# EAGLE design avalanche_PSU (EAGLE 6.5.0)
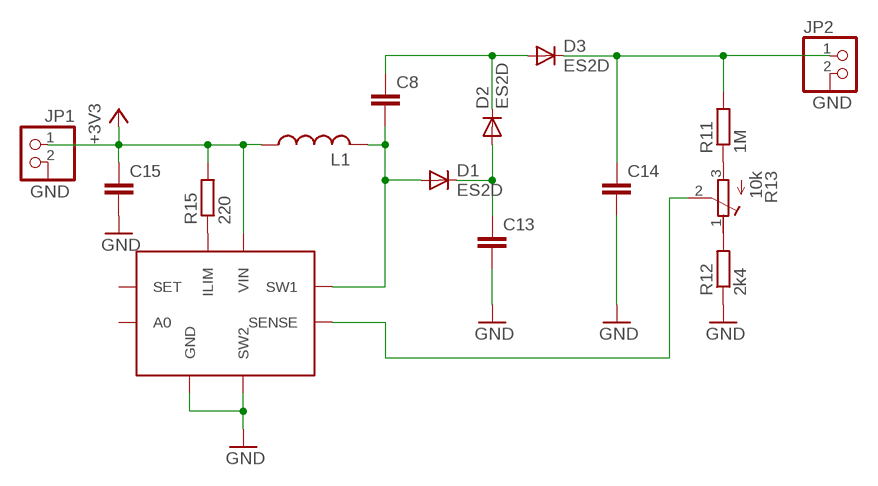
[diagram p0: schematic, sheet 1]

## Parts
C8  C-EUC0805K  [C0805K]
C13  C-EUC0805K  [C0805K]
C14  C-EUC0805K  [C0805K]
C15  C-EUC1206  [C1206]
D1  ES2D  [SMB]
D2  ES2D  [SMB]
D3  ES2D  [SMB]
JP1  PINHD-1X2  [1X02]
JP2  PINHD-1X2  [1X02]
L1  L-US  [SRR1280]
R11  1M  R-EU_M0805  [M0805]
R12  2k4  R-EU_M0805  [M0805]
R13  10k  R-TRIMMT18  [RTRIMT18]
R15  220  R-EU_M0805  [M0805]
U$3  LT1073  [DIL08]

## Nets
+3V3: C15.1 JP1.1 L1.P$1 R15.2 U$3.2(VIN)
GND: C13.2 C14.2 C15.2 JP1.2 JP2.2 R12.1 U$3.4(SW2) U$3.5(GND)
N$13: C13.1 D1.C D2.A
N$24: C8.1 D2.C D3.A
N$25: C14.1 D3.C JP2.1 R11.2
N$37: C8.2 D1.A L1.P$2 U$3.3(SW1)
N$38: R12.2 R13.1(A)
N$39: R11.1 R13.3(E)
N$40: R13.2(S) U$3.8(SENSE)
N$41: R15.1 U$3.1(ILIM)
Unconnected: U$3.6(A0) U$3.7(SET)

## Library data of the parts
C8 C13-C15 = resistor:C-EU: CAPACITOR, European symbol
D1-D3 = diode:ES2D: DIODE super fast rectifier, 2 A
JP1 JP2 = pinhead:PINHD-1X2: PIN HEADER
L1 = SRR1280:L-US: INDUCTOR, American symbol
R11 R12 R15 = resistor:R-EU_: RESISTOR, European symbol
R13 = resistor:R-TRIMM: Trimm resistor
U$3 = LT1073:LT1073

## Board
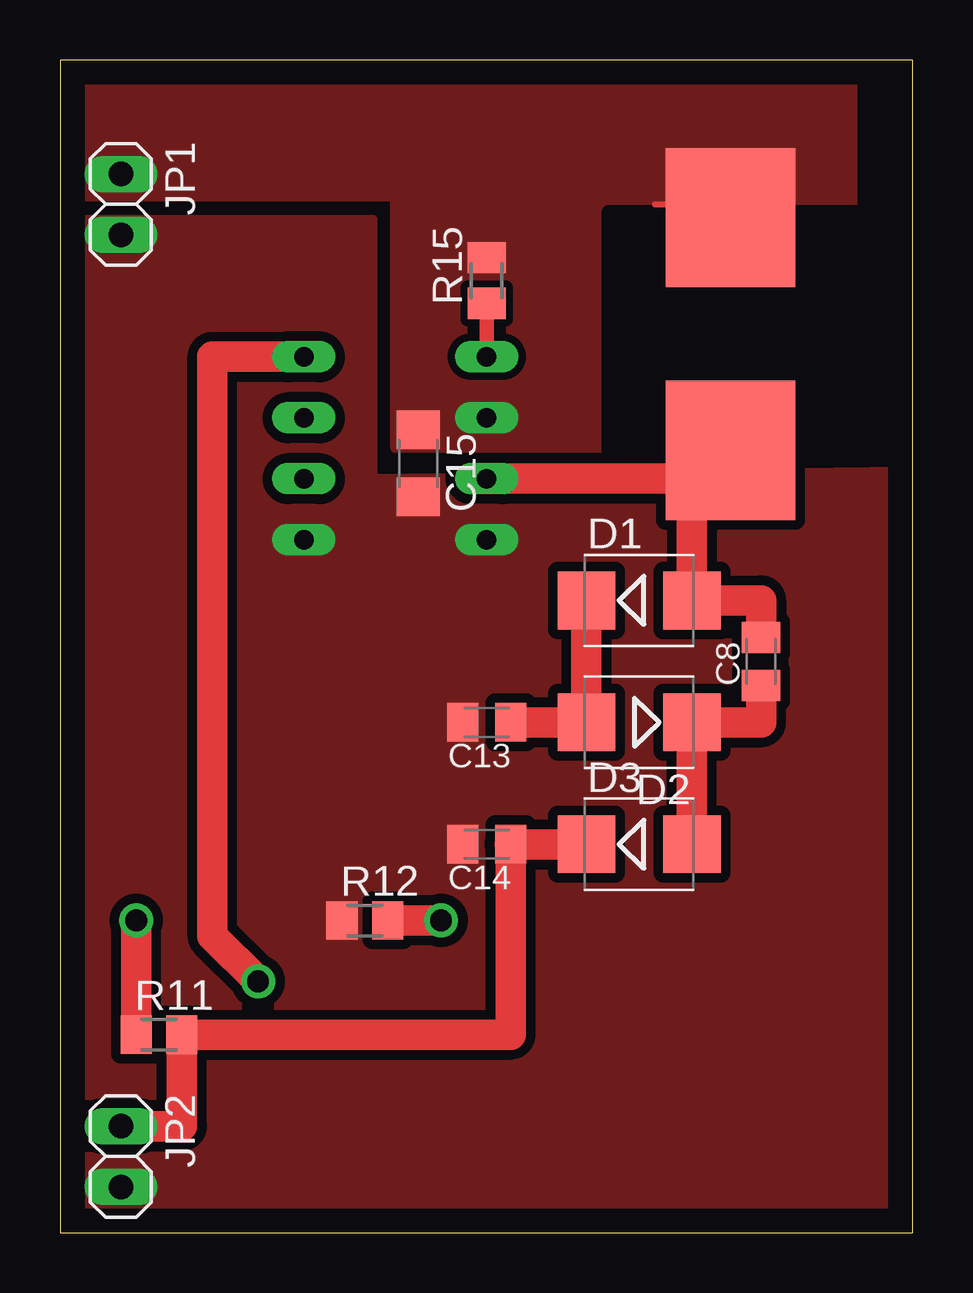
[diagram p1: board, top side]
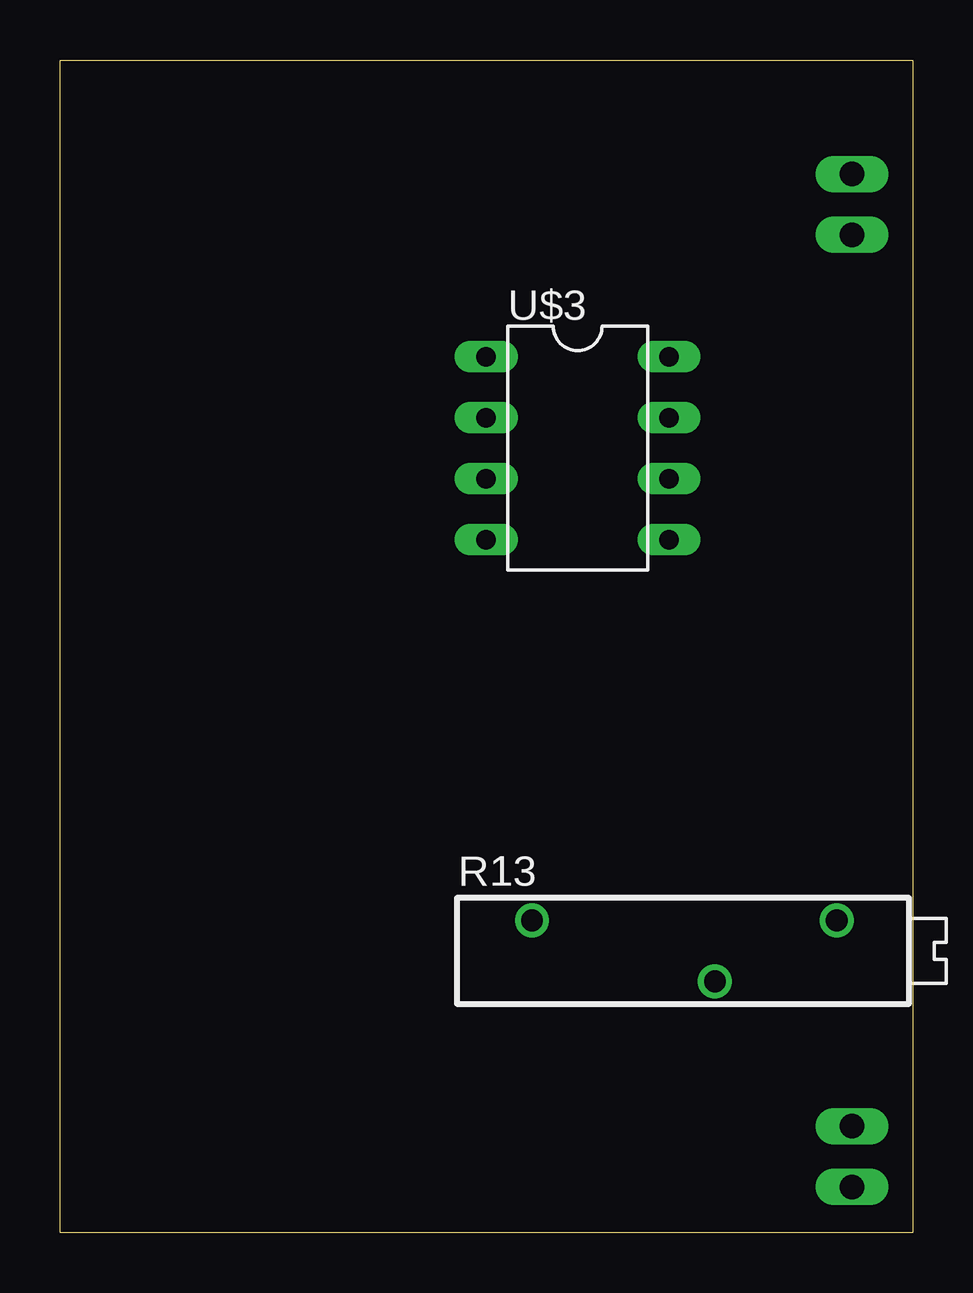
[diagram p2: board, bottom side, seen from below]

Size 35.54 x 48.88 mm. Coordinates in mm from the lower left corner, seen from the top.
Outline: 0,0 35.54,0 35.54,48.88 0,48.88 0,0
Copper layers (1*16): Top 0.035mm / dielectric 1.5mm / Bottom 0.035mm
Design rules "default": minimum track width 10mil, minimum drill 24mil, track to track 8mil, track to pad 8mil, pad to pad 8mil, via to via 8mil, smd to smd 8mil, copper to edge 40mil, drill to drill 8mil, minimum pad ring 10mil, minimum via ring 8mil, stop-mask expansion 4mil, vias tented up to drill 0mil, thermal gap 10mil

### Footprints (pad centres in the part's own frame; a part is rotated, then mirrored left to right if it is on the bottom)
C0805K = smd 1.3 x 1.6: 1 -1,0; 2 1,0
C1206 = smd 1.6 x 1.8: 1 -1.4,0; 2 1.4,0
SMB = smd 2.4 x 2.4: A 2.2,0; C -2.2,0
1X02 = drill 1.016 long: 1 -1.27,0; 2 1.27,0
SRR1280 = smd 5.8 x 5.4: P$1 -4.85,0; P$2 4.85,0
M0805 = smd 1.3 x 1.6: 1 -0.95,0; 2 0.95,0
RTRIMT18 = drill 0.9: 1 -7.62,1.27; 2 0,-1.27; 3 5.08,1.27
DIL08 = drill 0.813 long: 1 -3.81,-3.81; 2 -1.27,-3.81; 3 1.27,-3.81; 4 3.81,-3.81; 5 3.81,3.81; 6 1.27,3.81; 7 -1.27,3.81; 8 -3.81,3.81

### Placement (x,y rotation side)
C8  29.21,23.81 90 top
C13  17.78,21.27 180 top
C14  17.78,16.19 180 top
C15  14.92,32.07 270 top
D1  24.13,26.35 0 top
D2  24.13,21.27 180 top
D3  24.13,16.19 0 top
JP1  2.54,42.86 270 top
JP2  2.54,3.17 270 top
L1  27.94,37.47 270 top
R11  4.13,8.26 0 top
R12  12.7,13.02 0 top
R13  8.26,11.75 0 bottom
R15  17.78,39.69 90 top
U$3  13.97,32.7 270 bottom

### Tracks (layer width: path | path; a pad name or v marks a point on that pad's centre or on a via)
+3V3
  Top 0.254: 24.78,42.86 27.94,42.86 L1.P$1
  pour Top (isolate 0.305, no thermals): 0,49.21 33.02,49.21 33.02,32.7 13.97,32.7 13.97,43.18 0,43.18
GND
  pour Top (isolate 0.406, no thermals): 0,42.23 13.02,42.23 13.02,31.43 35.24,31.75 35.56,31.75 35.56,0 0,0
N$13
  Top 1.27: D1.C D2.A C13.1
N$24
  Top 1.27: C8.1 29.21,21.27 D2.C D3.A
N$25
  Top 1.27: C14.1 D3.C | C14.1 18.73,16.19 | C14.1 18.78,8.26 R11.2 5.08,4.45 JP2.1
N$37
  Top 1.27: U$3.3 26.33,31.43 | 28.57,31.7 28.57,31.43 27.94,31.43 | 27.94,31.43 L1.P$2 | C8.2 29.21,26.35 D1.A 26.33,31.43 | 27.94,31.43 26.33,31.43
N$38
  Top 1.27: R13.1 R12.2
N$39
  Top 1.27: R11.1 R13.3
N$40
  Top 1.27: R13.2 6.35,12.38 6.35,36.51 U$3.8
N$41
  Top 0.61: U$3.1 R15.1